# Altium project Connector_26P.PrjPcb
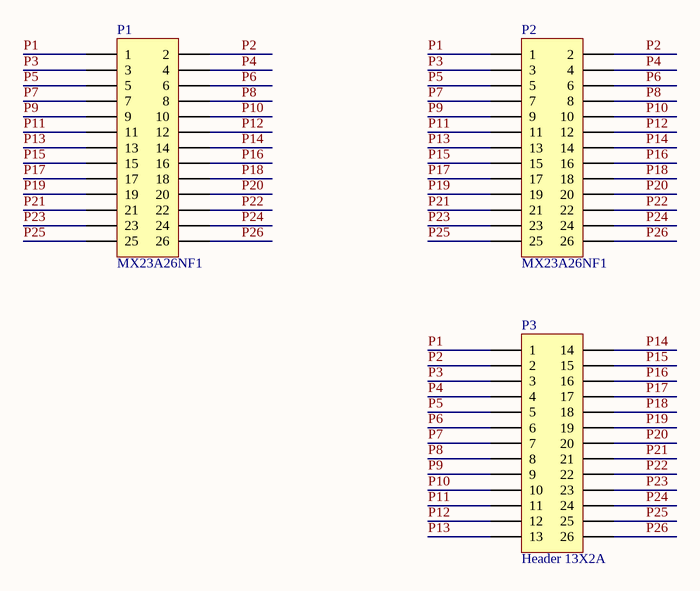
[diagram p0: Connector_26P.SchDoc]
1 sheet, 3 parts. Net scope: global (net labels, ports and power ports of the same name join across sheets).
Board file: Connector_26P.PcbDoc

## Sheet Connector_26P.SchDoc
size A4

### Parts
P1  MX23A26NF1  [MX23A26NF1]
P2  MX23A26NF1  [MX23A26NF1]
P3  Header 13X2A  [HDR2X13_CEN]

### Nets
P1: P1.1 P2.1 P3.1
P2: P1.2 P2.2 P3.2
P3: P1.3 P2.3 P3.3
P4: P1.4 P2.4 P3.4
P5: P1.5 P2.5 P3.5
P6: P1.6 P2.6 P3.6
P7: P1.7 P2.7 P3.7
P8: P1.8 P2.8 P3.8
P9: P1.9 P2.9 P3.9
P10: P1.10 P2.10 P3.10
P11: P1.11 P2.11 P3.11
P12: P1.12 P2.12 P3.12
P13: P1.13 P2.13 P3.13
P14: P1.14 P2.14 P3.14
P15: P1.15 P2.15 P3.15
P16: P1.16 P2.16 P3.16
P17: P1.17 P2.17 P3.17
P18: P1.18 P2.18 P3.18
P19: P1.19 P2.19 P3.19
P20: P1.20 P2.20 P3.20
P21: P1.21 P2.21 P3.21
P22: P1.22 P2.22 P3.22
P23: P1.23 P2.23 P3.23
P24: P1.24 P2.24 P3.24
P25: P1.25 P2.25 P3.25
P26: P1.26 P2.26 P3.26

### Library data of the parts
P1 P2 = MHDR2X13: Header, 13-Pin, Dual row; LatestRevisionDate: 17-Jul-2002; LatestRevisionNote: Re-released for DXP Platform.; Publisher: Altium Limited
P3 = Header 13X2A: Header, 13-Pin, Dual row; LatestRevisionDate: 17-Jul-2002; LatestRevisionNote: Re-released for DXP Platform.; Publisher: Altium Limited